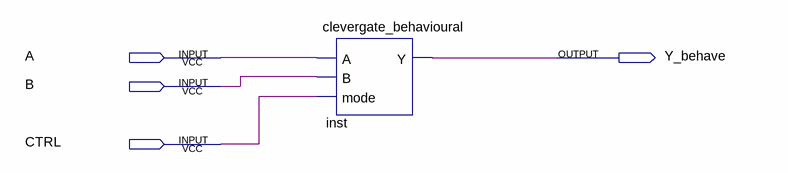
[diagram p0: schematic sheet]
// Quartus schematic behavioural.bdf as structural Verilog: 1 symbols, 4 pins
module behavioural (
  input  A,
  input  B,
  input  CTRL,
  output Y_behave
);

  clevergate_behavioural inst (.A(A), .B(B), .mode(CTRL), .Y(Y_behave));
endmodule
